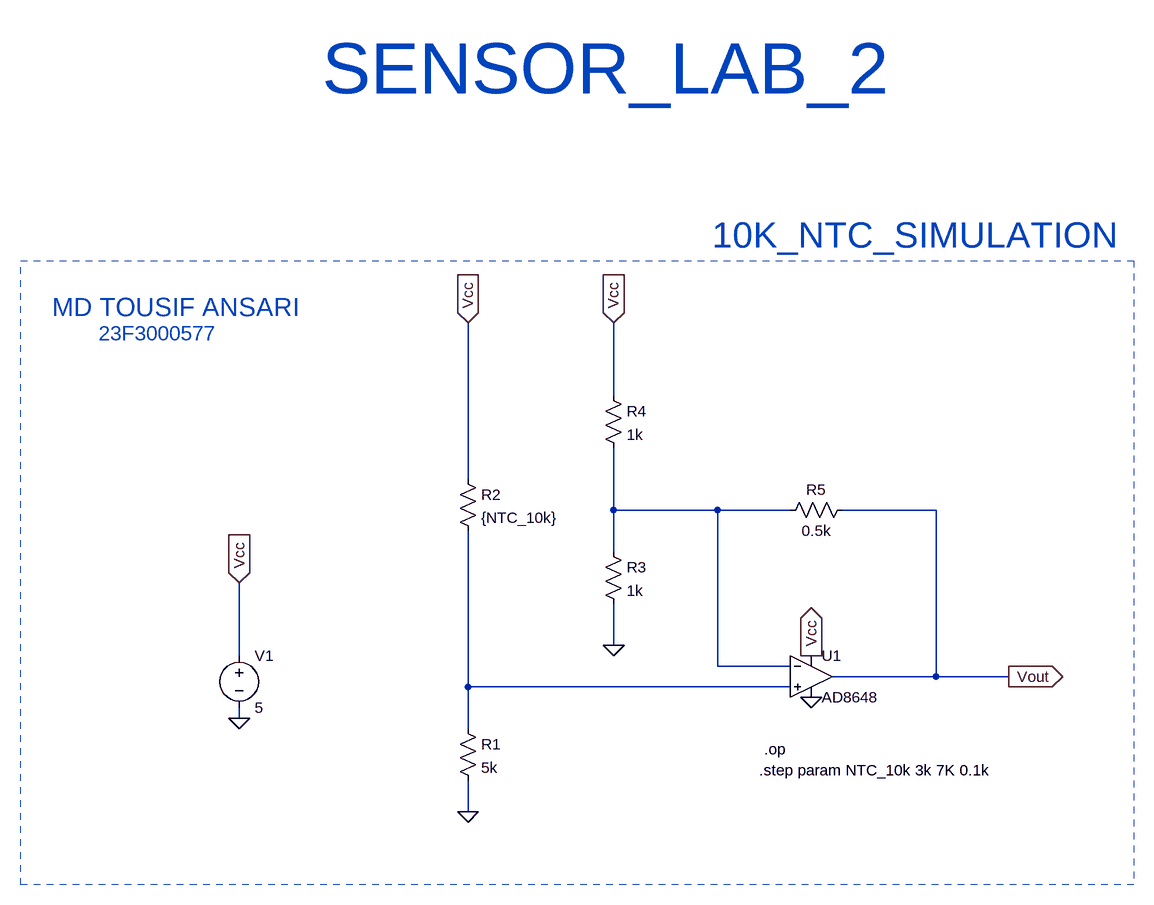
[diagram p0: schematic NTC_10k.asc]
NTC_10k.asc, the LTspice schematic file:
Version 4.1
SHEET 1 880 680
WIRE -16 -288 -16 -400
WIRE -240 -160 -240 -400
WIRE -16 -112 -16 -208
WIRE 144 -112 -16 -112
WIRE 256 -112 144 -112
WIRE 480 -112 336 -112
WIRE -16 -48 -16 -112
WIRE -16 96 -16 32
WIRE -592 112 -592 0
WIRE 144 128 144 -112
WIRE 256 128 144 128
WIRE 480 144 480 -112
WIRE 480 144 320 144
WIRE 592 144 480 144
WIRE -240 160 -240 -80
WIRE 256 160 -240 160
WIRE -592 208 -592 192
WIRE -240 224 -240 160
WIRE -240 352 -240 304
FLAG -592 208 0
FLAG -592 0 Vcc
IOPIN -592 0 In
FLAG 288 112 Vcc
IOPIN 288 112 Out
FLAG -240 352 0
FLAG -16 96 0
FLAG 288 176 0
FLAG 592 144 Vout
IOPIN 592 144 Out
FLAG -240 -400 Vcc
IOPIN -240 -400 In
FLAG -16 -400 Vcc
IOPIN -16 -400 In
SYMBOL OpAmps\\AD8648 288 80 R0
SYMATTR InstName U1
SYMBOL voltage -592 96 R0
SYMATTR InstName V1
SYMATTR Value 5
SYMBOL res -256 208 R0
SYMATTR InstName R1
SYMATTR Value 5k
SYMBOL res -256 -176 R0
SYMATTR InstName R2
SYMATTR Value {NTC_10k}
SYMBOL res -32 -64 R0
SYMATTR InstName R3
SYMATTR Value 1k
SYMBOL res -32 -304 R0
SYMATTR InstName R4
SYMATTR Value 1k
SYMBOL res 352 -128 R90
WINDOW 0 0 56 VBottom 2
WINDOW 3 32 56 VTop 2
SYMATTR InstName R5
SYMATTR Value 0.5k
TEXT 208 288 Left 2 !.step param NTC_10k 3k 7K 0.1k
TEXT 216 256 Left 2 !.op
TEXT -464 -792 Left 7 ;SENSOR_LAB_2
TEXT 136 -536 Left 5 ;10K_NTC_SIMULATION
TEXT -880 -424 Left 4 ;MD TOUSIF ANSARI
TEXT -808 -384 Left 3 ;23F3000577
RECTANGLE Normal 784 464 -928 -496 1

The netlist it stands for:
* NTC_10k.asc
X§U1 N002 N001 Vcc 0 Vout AD8648  ; pins In+ In- V+ V- OUT
V1 Vcc 0 5
R1 N002 0 5k
R2 Vcc N002 {NTC_10k}
R3 N001 0 1k
R4 Vcc N001 1k
R5 Vout N001 0.5k
.step param NTC_10k 3k 7K 0.1k
.op
* SENSOR_LAB_2
* 10K_NTC_SIMULATION
* MD TOUSIF ANSARI
* 23F3000577
.lib ADI.lib
.backanno
.end